# EAGLE design piezo-preamp-tickler_V3-4_single-supply-OPA1642 (EAGLE 8.5.0)

## Sheet 1 of 2
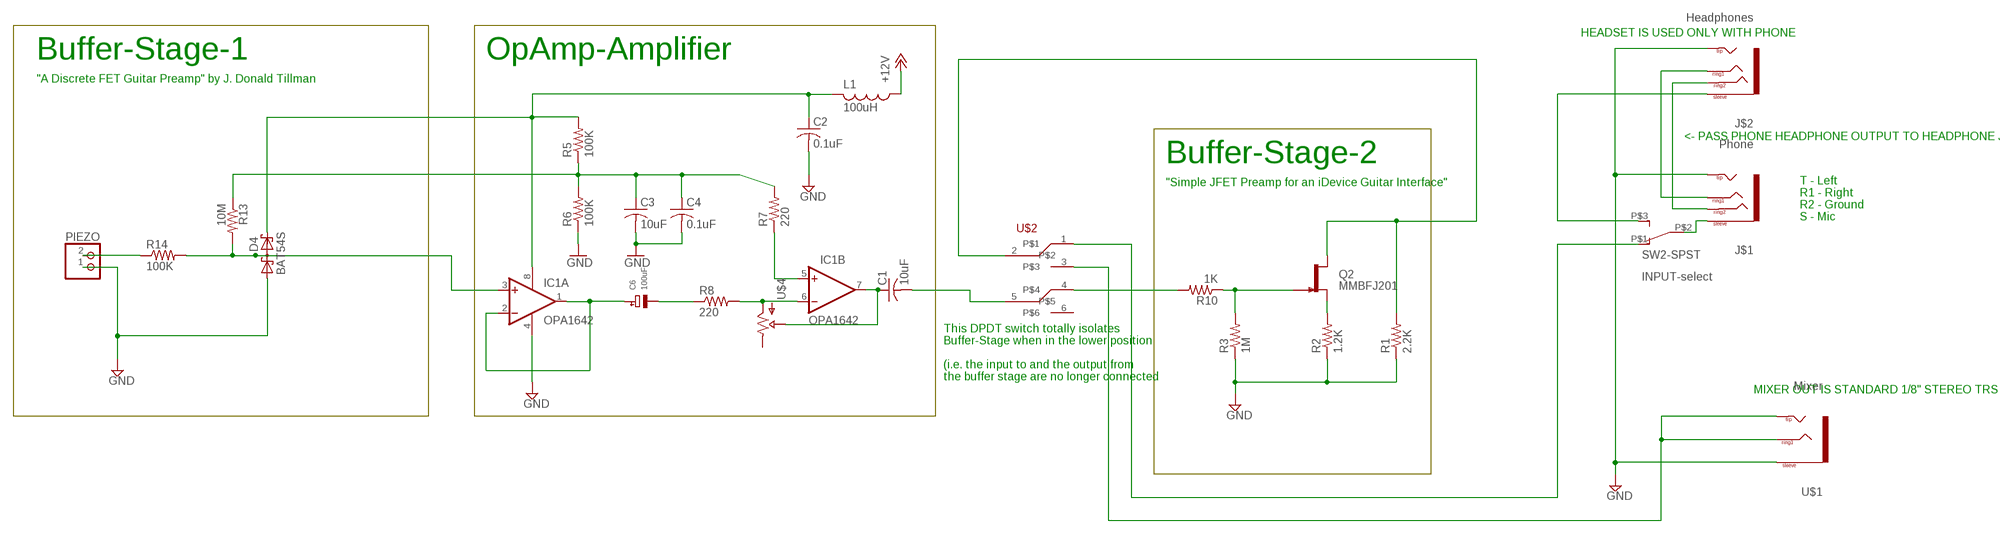
[diagram p0: schematic, sheet 1]

### Parts
C1  10uF  C-USC0805  [C0805]
C2  0.1uF  C-USC0805K  [C0805K]
C3  10uF  C-USC0805K  [C0805K]
C4  0.1uF  C-USC0805K  [C0805K]
C6  100uF  CAP_TANTALUMA/3216_REFLOW  [EIA3216-18/A-R]
D4  BAT54S  [SOT23]
IC1  OPA1642  OPA2134UA  [SO08]
J$1  Phone  TRRS-3.5MMLGPADS  [TRRS_SJ-43514-SMT-TR]
J$2  Headphones  TRRS-3.5MMLGPADS  [TRRS_SJ-43514-SMT-TR]
L1  100uH  L-USL3225P  [L3225P]
PIEZO  JST_2PIN-THM  [JST-PH-2-THM]
Q2  MMBFJ201  J201SOT-23  [SOT23-3]
R1  2.2K  R-US_R0603  [R0603]
R2  1.2K  R-US_R0603  [R0603]
R3  1M  R-US_R0603  [R0603]
R5  100K  R-US_R0603  [R0603]
R6  100K  R-US_R0603  [R0603]
R7  220  R-US_R0603  [R0603]
R8  220  R-US_R0603  [R0603]
R10  1K  R-US_R0603  [R0603]
R13  10M  R-US_R0603  [R0603]
R14  100K  R-US_R0603  [R0603]
SW2-SPST  INPUT-select  SWITCH_SPDTCL-SB-12B  [SWITCH_SPDT_CL-SB-12B]
U$1  Mixer  TRS-1/8"-3.5MM  [TRS_SJ-3524-SMT]
U$2  SWITCH_DPDT  [SWITCH_DPDT_CL-SB-22B]
U$4  POTPOT-THUMB-ALPHA  [POT-THUMB-14MM_ALPHA-RV100F-30-4K1B-B10K-B301]

### Nets
+12V: L1.1 ; also sheet 2
GND: C2.2 C3.2 C4.2 D4.1(A1) IC1.4(A:V-) J$1.TIP J$2.TIP PIEZO.1 R1.1 R2.1 R3.1 R6.1 U$1.1(SLEEVE) ; also sheet 2
N$2: PIEZO.2 R14.1
N$3: Q2.2(S) R2.2
N$4: J$2.EARTH(SLEEVE)
N$5: IC1.5(B:+IN) R7.1
N$6: C1.1 IC1.7(B:OUT) U$4.P$3(WIPER)
N$7: IC1.6(B:-IN) R8.2 U$4.P$1(IN)
N$9: D4.3(C1A2) IC1.3(A:+IN) R13.2 R14.2
N$10: Q2.3(G) R3.2 R10.1
N$11: R10.2 U$2.4
N$12: U$1.2(TIP) U$1.3(RING1) U$1.4(TIP) U$2.3
N$13: J$1.RING1 J$2.RING1
N$14: C6.- R8.1
N$15: J$1.RING2 J$2.RING2
N$16: C1.2 U$2.5
N$17: J$1.EARTH(SLEEVE) SW2-SPST.P$2
N$19: SW2-SPST.P$1 U$2.1
N$23: C3.1 C4.1 R5.1 R6.2 R7.2 R13.1
N$24: C6.+ IC1.1(A:OUT) IC1.2(A:-IN)
N$25: C2.1 D4.2(C2) IC1.8(A:V+) L1.2 R5.2
SELECT: Q2.1(D) R1.2 U$2.2
Unconnected: SW2-SPST.P$3 U$2.6 U$4.P$2(OUT)

### Notes on the sheet
- HEADSET IS USED ONLY WITH PHONE
- Buffer-Stage-1 | OpAmp-Amplifier
- "A Discrete FET Guitar Preamp" by J. Donald Tillman
- <- PASS PHONE HEADPHONE OUTPUT TO HEADPHONE JACK
- Buffer-Stage-2
- "Simple JFET Preamp for an iDevice Guitar Interface"
- T - Left
  R1 - Right
  R2 - Ground
  S - Mic
- This DPDT switch totally isolates 
  Buffer-Stage when in the lower position
  
  (i.e. the input to and the output from 
  the buffer stage are no longer connected
- MIXER OUT IS STANDARD 1/8" STEREO TRS

## Sheet 2 of 2
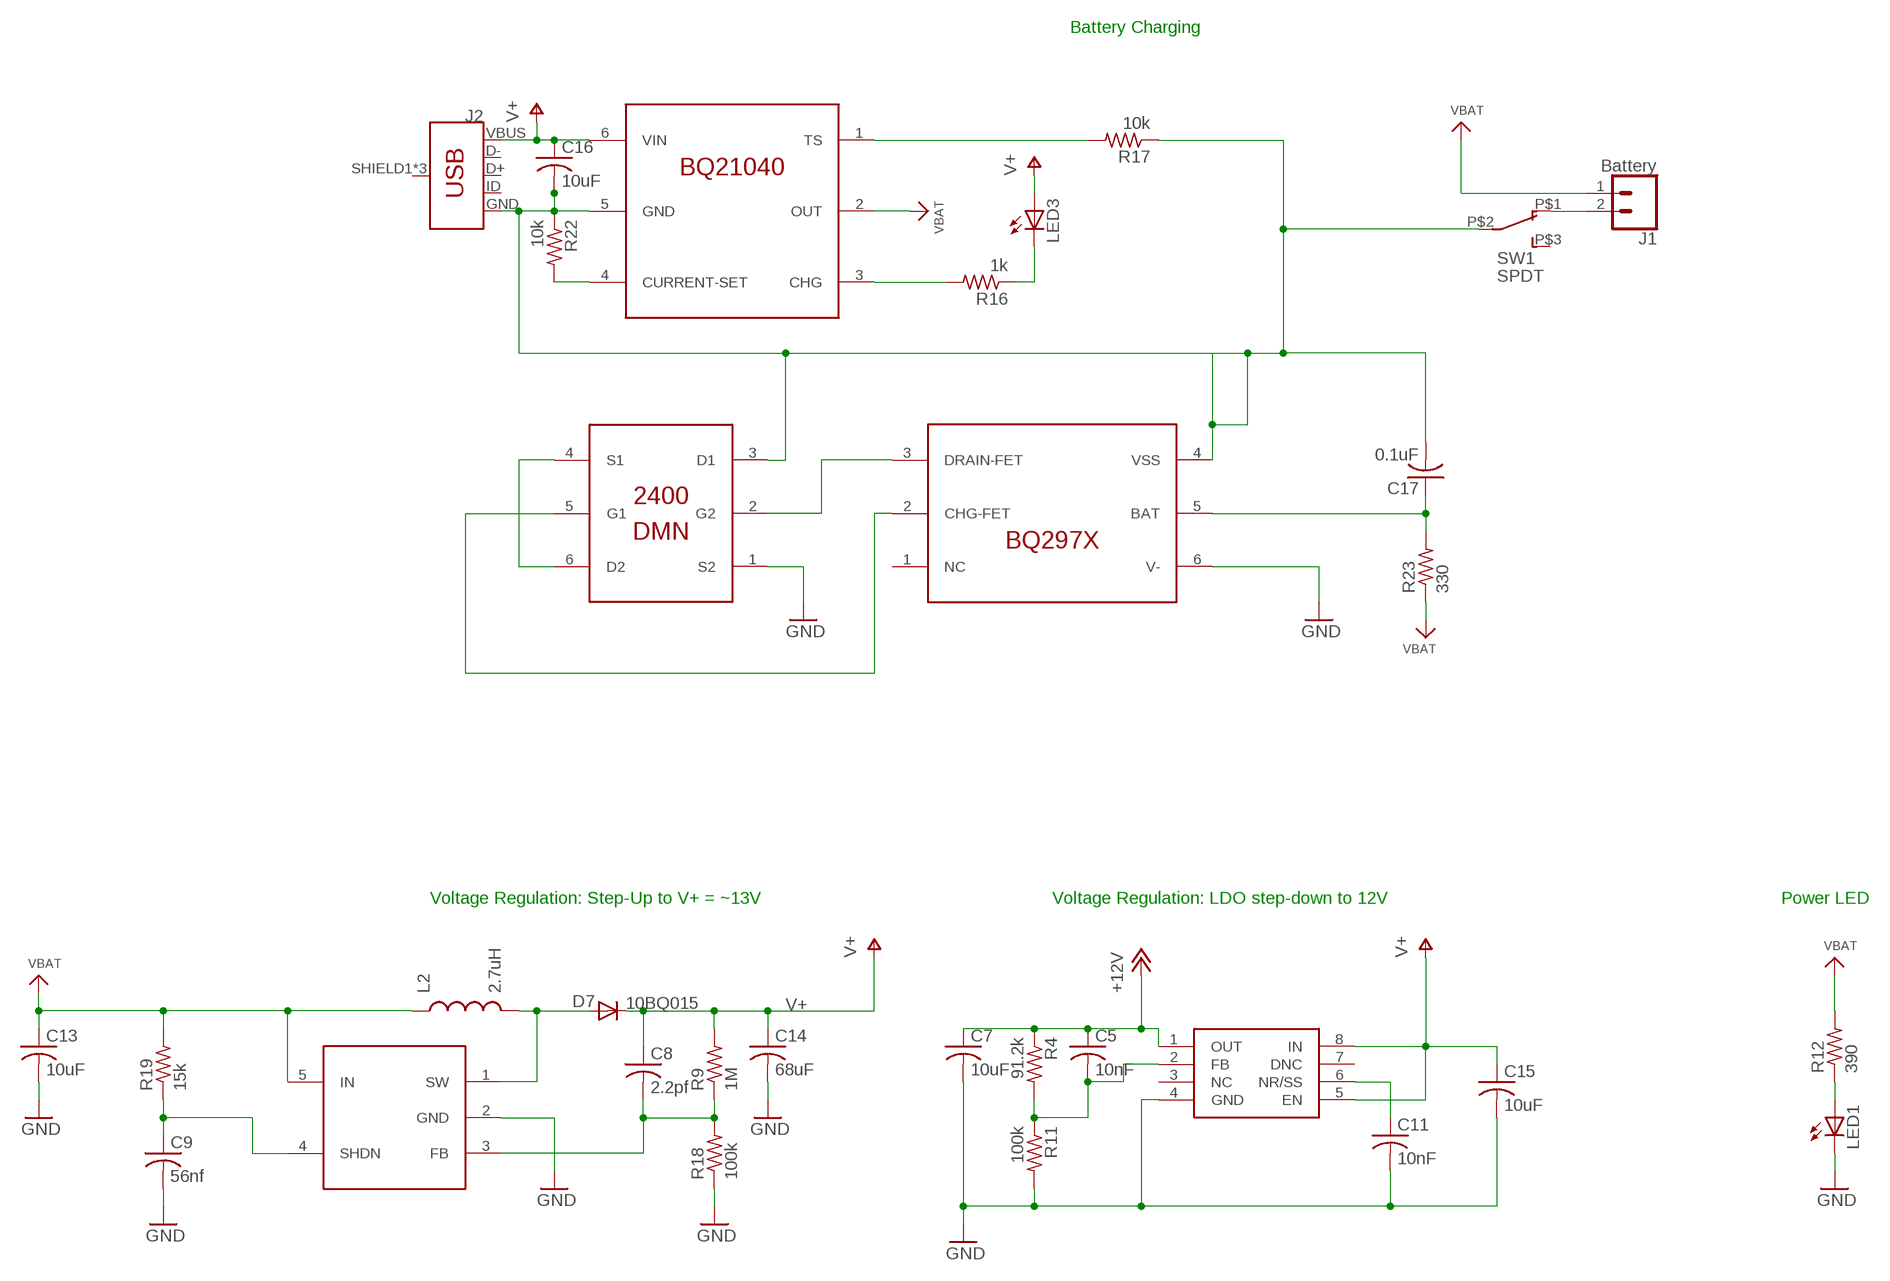
[diagram p1: schematic, sheet 2]

### Parts
C5  10nF  C-USC0603  [C0603]
C7  10uF  C-USC0603  [C0603]
C8  2.2pf  C-USC0603  [C0603]
C9  56nf  C-USC0603  [C0603]
C11  10nF  C-USC0603  [C0603]
C13  10uF  C-USC0603  [C0603]
C14  68uF  C-USC0603  [C0603]
C15  10uF  C-USC0603  [C0603]
C16  10uF  C-USC0805K  [C0805K]
C17  0.1uF  C-USC0805K  [C0805K]
D7  10BQ015  DIODESMA  [SMA-DIODE]
IC2  TPS7A49  [MSOP-8]
IC3  DMN2400  DUAL-NFET-DMN2400  [SOT-563]
IC4  BQ297X  BQ297X-BATTERY-MANAGER  [WSON-6]
J1  Battery  CONN_02LOCK  [1X02_LOCK]
J2  USB_MICRO-BREDUCED_PASTE  [USB-B-MICRO-SMD_RED_PASTE]
L2  2.7uH  INDUCTORCR54  [CR54]
LED1  LED3MM  [LED3MM]
LED3  LED3MM  [LED3MM]
Q1  BQ21040  BQ21040-LIPO-CHARGER  [SOT23-6]
Q3  SC4503  [SOT23-5]
R4  91.2k  R-US_R0603  [R0603]
R9  1M  R-US_R0603  [R0603]
R11  100k  R-US_R0603  [R0603]
R12  390  R-US_R0805  [R0805]
R16  1k  R-US_R0805  [R0805]
R17  10k  R-US_R0805  [R0805]
R18  100k  R-US_R0603  [R0603]
R19  15k  R-US_R0603  [R0603]
R22  10k  R-US_R0805  [R0805]
R23  330  R-US_R0805  [R0805]
SW1  SPDT  SWITCH_SPDTCL-SB-12B  [SWITCH_SPDT_CL-SB-12B]

### Nets
+12V: C5.1 C7.1 IC2.1(OUT) R4.1 ; also sheet 1
GND: C7.2 C9.2 C11.2 C13.2 C14.2 C15.2 IC2.4(GND) IC3.1(S2) IC4.6(V-) LED1.K(C) Q3.2(GND) R11.2 R18.1 ; also sheet 1
GND2: C16.2 C17.2 IC3.3(D1) IC4.4(VSS) J2.GND Q1.5(GND) R17.1 R22.1 SW1.P$2
N$18: LED1.A R12.1
N$20: J1.2 SW1.P$1
N$22: LED3.K(C) R16.1
N$26: C5.2 IC2.2(FB) R4.2 R11.1
N$27: Q1.3(CHG) R16.2
N$28: C11.1 IC2.6(NR/SS)
N$29: C9.1 Q3.4(SHDN) R19.1
N$30: C8.2 Q3.3(FB) R9.1 R18.2
N$31: Q1.1(TS) R17.2
N$32: D7.A L2.P$2 Q3.1(SW)
N$36: Q1.4(CURRENT-SET) R22.2
N$42: C17.1 IC4.5(BAT) R23.2
N$43: IC3.4(S1) IC3.6(D2)
N$44: IC3.5(G1) IC4.2(CHG-FET)
N$45: IC3.2(G2) IC4.3(DRAIN-FET)
V+: C8.1 C14.1 C15.1 C16.1 D7.C IC2.5(EN) IC2.8(IN) J2.VBUS LED3.A Q1.6(VIN) R9.2
VBAT: C13.1 J1.1 L2.P$1 Q1.2(OUT) Q3.5(IN) R12.2 R19.2 R23.1
Unconnected: IC2.3(NC) IC2.7(DNC) IC4.1(NC) J2.D+ J2.D- J2.ID J2.SHIELD1(SHIELD) J2.SHIELD2(SHIELD) J2.SHIELD3(SHIELD) SW1.P$3

### Notes on the sheet
- Battery Charging
- Voltage Regulation: Step-Up to V+ = ~13V | Voltage Regulation: LDO step-down to 12V | Power LED

## Library data of the parts
C1-C5 C7-C9 C11 C13-C17 = adafruit:C-US: CAPACITOR, American symbol
C6 = microbuilder:CAP_TANTALUM: Tantalum Capacitors Wave footprints have larger pads and are meant to be used for hand soldering. Reflow footprints are optimised for solder paste and a reflow oven. EIA3216-18/A-[R/W] - Size A / 3216-18 / 1206 footprint 4.7µF 25V 10% Tantalum Capacitor 10µF 16V 10% Tantalum Capacitor [Digikey: 495-2236-2-ND] EIA3528-21/B-[R/W] - Size B / 3528-21 47µF 10V 10% Tantalum Capactior [Digikey: 495-2216-1-ND] EIA6032-28/C-[R/W] - Size C / 6032-28 10µF 35V 20% Tantalum Capacitor [Digikey: 495-2285-1-ND] 100µF 16V 10% Tantalum Capactior [Digikey: 399-5214-1-ND]
D4 = diode:BAT54S: Schottky Diodes Pin connection corrected 2011-05-04 Source: Fairchild .. BAT54.pdf
D7 = SparkFun:DIODE: Diode These are standard reverse protection diodes and small signal diodes. SMA package can handle up to about 1A. SOD-323 can handle about 200mA. What the SOD-323 package when ordering, there are some mfgs out there that are 5-pin packages.
IC1 = linear:OPA2*: Dual Operational Amplifier Low Power, Single-Supply, Rail-To-Rail Operational Amplifier Source: http://focus.ti.com/lit/ds/symlink/opa2345.pdf http://focus.ti.com .. opa241.pdf http://focus.ti.com/lit/ds/symlink/opa2134.pdf
IC2 = CMU-ArtFab:TPS7A49
IC3 = CMU-ArtFab:DUAL-NFET-DMN2400
IC4 = CMU-ArtFab:BQ297X-BATTERY-MANAGER
J1 = SparkFun-Connectors:CONN_02: Multi connection point. Often used as Generic Header-pin footprint for 0.1 inch spaced/style header connections On any of the 0.1 inch spaced packages, you can populate with these: Break Away Headers - Straight <https://www.sparkfun.com/products/116> (PRT-00116) Break Away Male Headers - Right Angle <https://www.sparkfun.com/products/553> (PRT-00553) Female Headers <https://www.sparkfun.com/products/115> (PRT-00115) Break Away Headers - Machine Pin <https://www.sparkfun.com/products/117> (PRT-00117) Break Away Female Headers - Swiss Machine Pin <https://www.sparkfun.com/products/743> (PRT-00743) For SCREWTERMINALS and SPRING TERMINALS visit here: Screw Terimnals on SparkFun.com <https://www.sparkfun.com/search/results?term=Screw+Terminals> (5mm/3.5mm/2.54mm spacing) This device is also useful as a general connection point to wire up your design to another part of your project. Our various solder wires solder well into these plated through hole pads. Hook-Up Wire - Assortment (Stranded, 22 AWG) <https://www.sparkfun.com/products/11375> (PRT-11375) Hook-Up Wire - Assortment (Solid Core, 22 AWG) <https://www.sparkfun.com/products/11367> (PRT-11367) View the entire wire category on our website here <https://www.sparkfun.com/categories/141> Special notes: Molex polarized connector foot print use with: PRT-08233 with associated crimp pins and housings. 2.54_SCREWTERM for use with PRT-10571. 3.5mm Screw Terminal footprints for PRT-08084 5mm Screw Terminal footprints for use with PRT-08432
J2 = SparkFun-Connectors:USB_MICRO-B: USB Type Micro-B Connector Male/female and PTH/SMT variants SparkFun Products: SparkFun microB USB Breakout <https://www.sparkfun.com/products/12035> SparkFun USB microB Plug Breakout <https://www.sparkfun.com/products/10031> SparkFun ESP8266 Thing <https://www.sparkfun.com/products/13231>; PROD_ID: CONN-11752
J$1 J$2 = CMU-ArtFab:TRRS-3.5MM: Audio jack - 3.5mm TRRS variety - two rings.
L1 = rcl:L-US: INDUCTOR, American symbol; SPICEPREFIX: L
L2 = SparkFun-Passives:INDUCTOR: Inductors Basic Inductor/Choke - 0603 and 1206. Footprints are not proven and vary greatly between part numbers. SRN6045- 33uH, 20% 1.4A SDR0403-560KL - 56uH, 10%, 500mA RMS/740mA peak
LED1 LED3 = led:LED: LED OSRAM: - CHIPLED LG R971, LG N971, LY N971, LG Q971, LY Q971, LO R971, LY R971 LH N974, LH R974 LS Q976, LO Q976, LY Q976 LO Q996 - Hyper CHIPLED LW Q18S LB Q993, LB Q99A, LB R99A - SideLED LS A670, LO A670, LY A670, LG A670, LP A670 LB A673, LV A673, LT A673, LW A673 LH A674 LY A675 LS A676, LA A676, LO A676, LY A676, LW A676 LS A679, LY A679, LG A679 - Hyper Micro SIDELED® LS Y876, LA Y876, LO Y876, LY Y876 LT Y87S - SmartLED LW L88C, LW L88S LB L89C, LB L89S, LG L890 LS L89K, LO L89K, LY L89K LS L896, LA L896, LO L896, LY L896 - TOPLED LS T670, LO T670, LY T670, LG T670, LP T670 LSG T670, LSP T670, LSY T670, LOP T670, LYG T670 LG T671, LOG T671, LSG T671 LB T673, LV T673, LT T673, LW T673 LH T674 LS T676, LA T676, LO T676, LY T676, LB T676, LH T676, LSB T676, LW T676 LB T67C, LV T67C, LT T67C, LS T67K, LO T67K, LY T67K, LW E67C LS E67B, LA E67B, LO E67B, LY E67B, LB E67C, LV E67C, LT E67C LW T67C LS T679, LY T679, LG T679 LS T770, LO T770, LY T770, LG T770, LP T770 LB T773, LV T773, LT T773, LW T773 LH T774 LS E675, LA E675, LY E675, LS T675 LS T776, LA T776, LO T776, LY T776, LB T776 LHGB T686 LT T68C, LB T68C - Hyper Mini TOPLED® LB M676 - Mini TOPLED Santana® LG M470 LS M47K, LO M47K, LY M47K Source: http://www.osram.convergy.de LUXEON: - LUMILED® LXK2-PW12-R00, LXK2-PW12-S00, LXK2-PW14-U00, LXK2-PW14-V00 LXK2-PM12-R00, LXK2-PM12-S00, LXK2-PM14-U00 LXK2-PE12-Q00, LXK2-PE12-R00, LXK2-PE12-S00, LXK2-PE14-T00, LXK2-PE14-U00 LXK2-PB12-K00, LXK2-PB12-L00, LXK2-PB12-M00, LXK2-PB14-N00, LXK2-PB14-P00, LXK2-PB14-Q00 LXK2-PR12-L00, LXK2-PR12-M00, LXK2-PR14-Q00, LXK2-PR14-R00 LXK2-PD12-Q00, LXK2-PD12-R00, LXK2-PD12-S00 LXK2-PH12-R00, LXK2-PH12-S00 LXK2-PL12-P00, LXK2-PL12-Q00, LXK2-PL12-R00 Source: www.luxeon.com KINGBRIGHT: KA-3528ASYC Source: www.kingbright.com
PIEZO = adafruit:JST_2PIN: JST 2-Pin Connectors of various flavors SMT-RA (S2B-PH-SM4) 4UConnector #17311 SMT (B2B-PH-SM4) THM-RA (S2B-PH) THM (B2B-PH)
Q1 = CMU-ArtFab:BQ21040-LIPO-CHARGER
Q2 = CMU-ArtFab:J201: N-channel JFET
Q3 = CMU-ArtFab:SC4503
R1-R14 R16-R19 R22 R23 = CMU-ArtFab:R-US_: RESISTOR, American symbol
SW1 SW2-SPST = CMU-ArtFab:SWITCH_SPDT
U$1 = CMU-ArtFab:TRS-1/8"-3.5MM
U$2 = CMU-ArtFab:SWITCH_DPDT
U$4 = CMU-ArtFab:POT: http://www.taydaelectronics.com/10k-ohm-linear-taper-potentiometer-round-shaft-pcb-9mm.html http://www.taydaelectronics.com/datasheets/A-1847.pdf

## Board
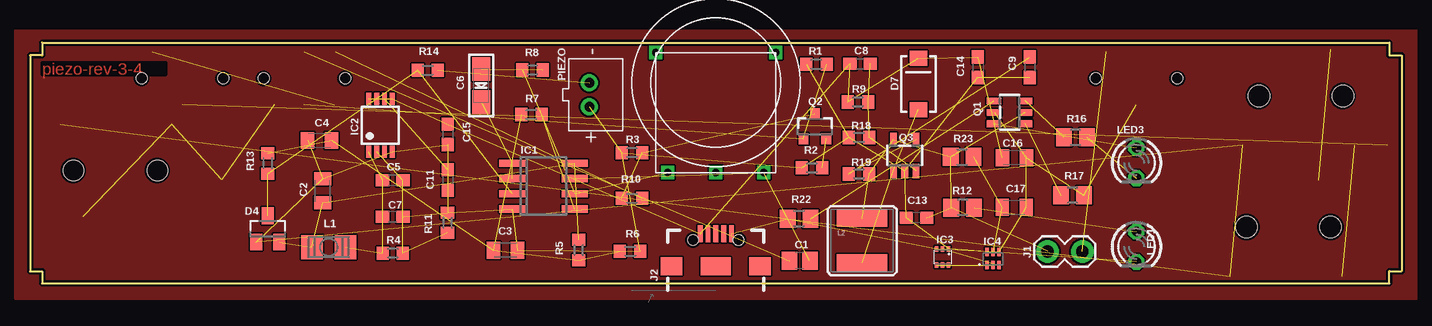
[diagram p2: board, top side]
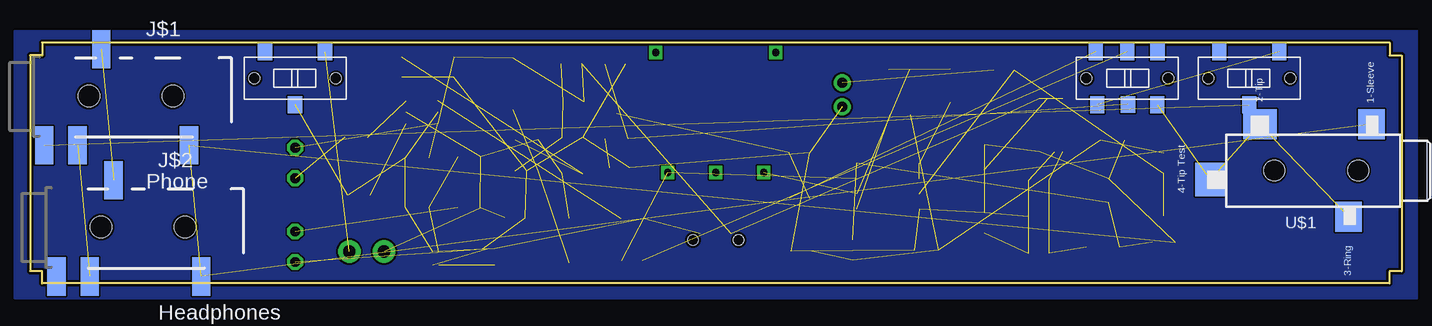
[diagram p3: board, bottom side, seen from below]

Size 114.3 x 20.07 mm. Coordinates in mm from the lower left corner, seen from the top.
Outline: 0,19 0,1 1.02,1 1.02,0 113.28,0 113.28,1.02 114.3,1.02 114.3,19 113.28,19 113.28,20.07 1,20.07 1,19 0,19
Copper layers (1*16): Top 0.035mm / dielectric 1.5mm / Bottom 0.035mm
Design rules "default *": minimum track width 6mil, minimum drill 0.35mm, track to track 6mil, track to pad 6mil, pad to pad 6mil, via to via 6mil, smd to smd 6mil, copper to edge 8mil, drill to drill 6mil, minimum pad ring 10mil, minimum via ring 8mil, stop-mask expansion 4mil, vias tented up to drill 20mil, thermal gap 10mil

### Footprints (pad centres in the part's own frame; a part is rotated, then mirrored left to right if it is on the bottom)
C0805 = smd 1.3 x 1.5: 1 -0.85,0; 2 0.85,0
C0805K = smd 1.1 x 1.4: 1 -1,0; 2 1,0
C0603 = smd 1.1 x 1: 1 -0.85,0; 2 0.85,0
EIA3216-18/A-R = smd 1.95 x 1.5: + 1.375,0; - -1.375,0
SOT23 = smd 1 x 1.4: 1 -0.95,-1.1; 2 0.95,-1.1; 3 0,1.1
SMA-DIODE = smd 1.27 x 1.47: A -2.15,0; C 2.15,0
SO08 = smd 0.6 x 2.2: 1 -1.905,-2.6; 2 -0.635,-2.6; 3 0.635,-2.6; 4 1.905,-2.6; 5 1.905,2.6; 6 0.635,2.6; 7 -0.635,2.6; 8 -1.905,2.6
MSOP-8 = smd 0.4 x 1: 1 -0.975,-2.2; 2 -0.325,-2.2; 3 0.325,-2.2; 4 0.975,-2.2; 5 0.975,2.2; 6 0.325,2.2; 7 -0.325,2.2; 8 -0.975,2.2
SOT-563 = smd 0.3 x 0.45: 1 -0.5,-0.675; 2 0,-0.675; 3 0.5,-0.675; 4 0.5,0.675; 5 0,0.675; 6 -0.5,0.675
WSON-6 = smd 0.3 x 0.7: 1 -0.5,-0.55; 2 0,-0.55; 3 0.5,-0.55; 4 0.5,0.55; 5 0,0.55; 6 -0.5,0.55
1X02_LOCK = drill 1.016 pad 1.88: 1 -0.178,0; 2 2.718,0
USB-B-MICRO-SMD_RED_PASTE = smd 1.45 x 0.4: D+ 2.725,0; D- 2.725,0.65; GND 2.725,-1.3; ID 2.725,-0.65; VBUS 2.725,1.3 | smd 1.5 x 1.8: SHIELD1 0,3.685; SHIELD2 0,-3.685 | smd 1.5 x 2.5: SHIELD3 0,0 | hole 0.85: 2.2,1.9; 2.2,-1.9
TRRS_SJ-43514-SMT-TR = smd 1.524 x 3.175: EARTH -2.114,-5.271; RING1 2.644,2.759; RING2 0.66,-5.271; TIP 9.948,-5.271 | hole 1.778: 1.6,-1.15; 8.6,-1.15
L3225P = smd 1.8 x 2: 1 -1.4,0; 2 1.4,0
CR54 = smd 4.2 x 1.4: P$1 0,1.85; P$2 0,-1.85
LED3MM = drill 0.813 octagon: A -1.27,0; K 1.27,0
JST-PH-2-THM = drill 0.8 pad 1.422: 1 1,0; 2 -1,0
SOT23-6 = smd 0.55 x 1.2: 1 -0.95,-1.3; 2 0,-1.3; 3 0.95,-1.3; 4 0.95,1.3; 5 0,1.3; 6 -0.95,1.3
SOT23-3 = smd 0.8 x 0.9: 1 -0.95,-1; 2 0.95,-1; 3 0,1.1
SOT23-5 = smd 0.55 x 1.2: 1 -0.95,-1.3; 2 0,-1.3; 3 0.95,-1.3; 4 0.95,1.3; 5 -0.95,1.3
R0603 = smd 1 x 1.1: 1 -0.85,0; 2 0.85,0
R0805 = smd 1.3 x 1.5: 1 -0.95,0; 2 0.95,0
SWITCH_SPDT_CL-SB-12B = smd 1.2 x 1.4: P$1 -2.5,-2.2; P$2 0,2.2; P$3 2.5,-2.2 | hole 0.9: -3.4,0; 3.4,0
TRS_SJ-3524-SMT = smd 2.5 x 2.2: 1 3.85,-4.6; 3 -3.85,-2.7 | smd 2.5 x 2.8: 2 3.85,4.7 | smd 2.8 x 2.5: 4 -0.75,8.85 | hole 1.7: 0,-3.5; 0,3.5
SWITCH_DPDT_CL-SB-22B = smd 1.2 x 1.4: 1 -2.5,-2.2; 2 0.05,-2.17; 3 2.5,-2.2; 4 -2.63,2.2; 5 0,2.2; 6 2.51,2.2 | hole 0.9: -3.4,0; 3.4,0
POT-THUMB-14MM_ALPHA-RV100F-30-4K1B-B10K-B301 = drill 0.6 square: P$1 -4,-7.5; P$2 0,-7.5; P$3 4,-7.5; P$4 -5,2.5; P$5 5,2.5

### Placement (x,y rotation side)
C1  64.14,1.87 180 top
C2  24.38,7.71 90 top
C3  39.62,2.76 0 top
C4  24.13,11.91 180 top
C5  30.23,8.6 0 top
C6  37.59,16.48 270 top
C7  30.23,5.56 0 top
C8  69.18,18.29 0 top
C9  83.31,18 270 top
C11  34.8,8.6 270 top
C13  73.88,5.46 180 top
C14  78.99,18 270 top
C15  34.8,12.41 270 top
C16  82.04,10.47 0 top
C17  82.02,6.33 0 top
D4  19.81,4.54 0 top
D7  74.04,16.61 90 top
IC1  42.8,8.1 270 top
IC2  29.21,13.18 0 top
IC3  76.06,2.19 180 top
IC4  80.25,2.06 0 top
J1  84.97,2.65 0 top
J2  57.15,1.41 90 top
J$1  111,16.76 0 bottom
J$2  109.98,5.84 0 bottom
L1  24.89,3.02 180 top
L2  69.34,3.56 0 top
LED1  92.2,3.05 270 top
LED3  92.2,10.03 270 top
PIEZO  46.61,15.72 270 top
Q1  81.64,14.25 90 top
Q2  65.41,13.05 0 top
Q3  72.9,10.67 0 top
R1  65.53,18.26 0 top
R2  65.15,9.62 0 top
R3  50.16,10.89 0 top
R4  30.23,2.51 0 top
R5  45.72,2.76 90 top
R6  50.01,2.67 180 top
R7  41.78,14.06 180 top
R8  41.88,17.78 180 top
R9  68.99,15.11 180 top
R10  50.16,7.08 0 top
R11  34.8,5.05 90 top
R12  77.72,6.32 180 top
R13  19.81,10 270 top
R14  33.15,17.75 180 top
R16  87.12,12.16 180 top
R17  86.88,7.34 180 top
R18  69.09,12.16 0 top
R19  69.09,9.11 0 top
R22  64.09,5.39 0 top
R23  77.68,10.53 0 top
SW1  92.2,17.08 180 bottom
SW2-SPST  12.7,17.08 180 bottom
U$1  7.11,9.4 90 bottom
U$2  22.86,17.08 0 bottom
U$4  57.15,16.73 0 top

### Tracks (layer width: path | path; a pad name or v marks a point on that pad's centre or on a via)
+12V  (4 unrouted)
GND  (25 unrouted)
GND2  (8 unrouted)
N$2  (1 unrouted)
N$3  (1 unrouted)
N$4
  pour Top: -1.27,21.05 -1.27,-1.27 115.57,-1.27 115.57,21.05
N$5  (1 unrouted)
N$6  (2 unrouted)
N$7  (2 unrouted)
N$8
  pour Bottom: -1.27,21.05 -1.27,-1.27 115.57,-1.27 115.57,21.05
N$9  (3 unrouted)
N$10  (2 unrouted)
N$11  (1 unrouted)
N$12  (3 unrouted)
N$13  (1 unrouted)
N$14  (1 unrouted)
N$15  (1 unrouted)
N$16  (1 unrouted)
N$17  (1 unrouted)
N$18  (1 unrouted)
N$19  (1 unrouted)
N$20  (1 unrouted)
N$22  (1 unrouted)
N$23  (5 unrouted)
N$24  (2 unrouted)
N$25  (4 unrouted)
N$26  (3 unrouted)
N$27  (1 unrouted)
N$28  (1 unrouted)
N$29  (2 unrouted)
N$30  (3 unrouted)
N$31  (1 unrouted)
N$32  (2 unrouted)
N$36  (1 unrouted)
N$42  (2 unrouted)
N$43  (1 unrouted)
N$44  (1 unrouted)
N$45  (1 unrouted)
SELECT  (2 unrouted)
V+  (10 unrouted)
VBAT  (7 unrouted)

### Text on the board
Top: piezo-rev-3-4